# EAGLE design Selector_Gain (EAGLE 6.5.0)

## Sheet 1 of 2: In. Selector
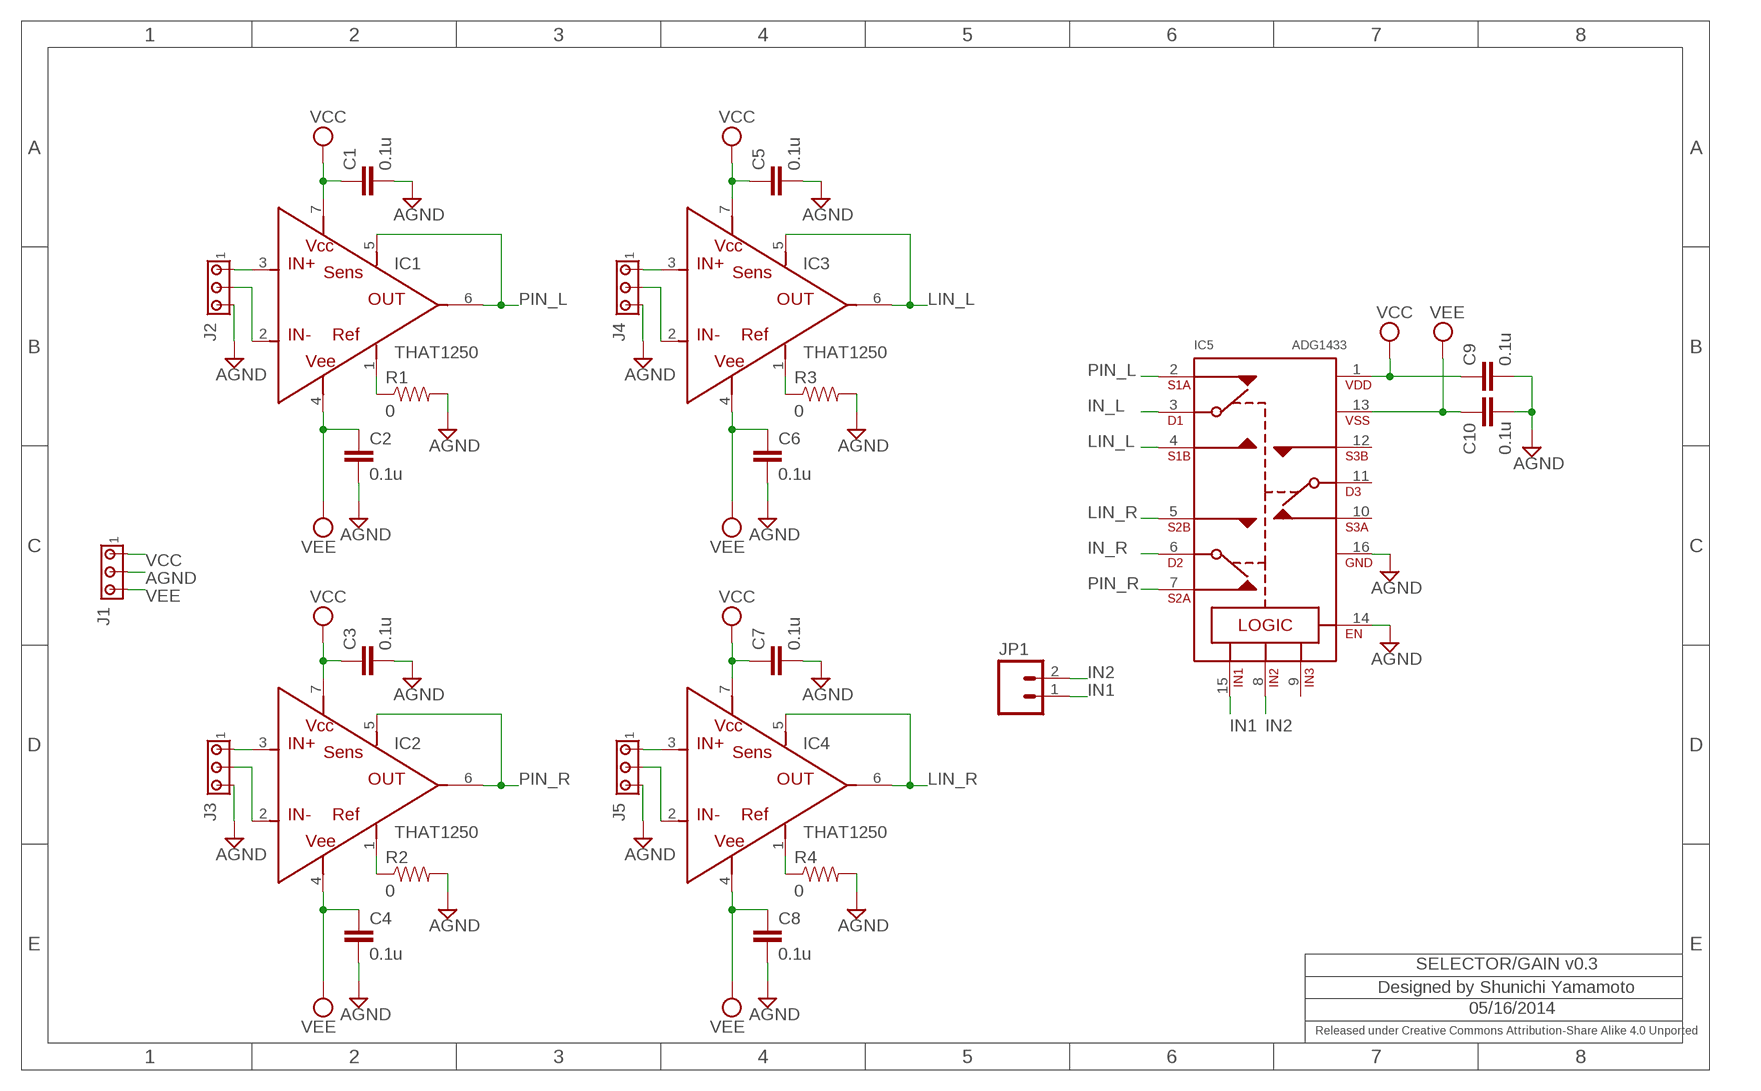
[diagram p0: schematic, sheet 1]

### Parts
C1  0.1u  C-EUC2012  [C2012]
C2  0.1u  C-EUC2012  [C2012]
C3  0.1u  C-EUC2012  [C2012]
C4  0.1u  C-EUC2012  [C2012]
C5  0.1u  C-EUC2012  [C2012]
C6  0.1u  C-EUC2012  [C2012]
C7  0.1u  C-EUC2012  [C2012]
C8  0.1u  C-EUC2012  [C2012]
C9  0.1u  C-EUC2012  [C2012]
C10  0.1u  C-EUC2012  [C2012]
IC1  THAT1250  [SOIC8]
IC2  THAT1250  [SOIC8]
IC3  THAT1250  [SOIC8]
IC4  THAT1250  [SOIC8]
IC5  ADG1433  [TSSOP16]
J1  MTA03-156  [1X3MTA]
J2  MTA03-100  [10X03MTA]
J3  MTA03-100  [10X03MTA]
J4  MTA03-100  [10X03MTA]
J5  MTA03-100  [10X03MTA]
JP1  M02PTH  [1X02]
R1  0  RESISTOR0805-RES  [0805]
R2  0  RESISTOR0805-RES  [0805]
R3  0  RESISTOR0805-RES  [0805]
R4  0  RESISTOR0805-RES  [0805]

### Nets
AGND: C1.2 C2.2 C3.2 C4.2 C5.2 C6.2 C7.2 C8.2 C9.2 C10.2 IC5.14(EN) IC5.16(GND) J1.2 J2.3 J3.3 J4.3 J5.3 R1.2 R2.2 R3.2 R4.2 ; also sheet 2
IN1: IC5.15(IN1) JP1.1
IN2: IC5.8(IN2) JP1.2
IN_L: IC5.3(D1) ; also sheet 2
IN_R: IC5.6(D2) ; also sheet 2
LIN_L: IC3.5(SENS) IC3.6(OUT) IC5.4(S1B)
LIN_R: IC4.5(SENS) IC4.6(OUT) IC5.5(S2B)
N$1: IC1.1(REF) R1.1
N$2: IC3.1(REF) R3.1
N$3: IC1.3(IN+) J2.1
N$4: IC1.2(IN-) J2.2
N$5: IC2.1(REF) R2.1
N$6: IC3.3(IN+) J4.1
N$7: IC2.3(IN+) J3.1
N$8: IC2.2(IN-) J3.2
N$9: IC3.2(IN-) J4.2
N$10: IC4.1(REF) R4.1
N$11: IC4.3(IN+) J5.1
N$12: IC4.2(IN-) J5.2
PIN_L: IC1.5(SENS) IC1.6(OUT) IC5.2(S1A)
PIN_R: IC2.5(SENS) IC2.6(OUT) IC5.7(S2A)
VCC: C1.1 C3.1 C5.1 C7.1 C9.1 IC1.7(VCC) IC2.7(VCC) IC3.7(VCC) IC4.7(VCC) IC5.1(VDD) J1.1 ; also sheet 2
VEE: C2.1 C4.1 C6.1 C8.1 C10.1 IC1.4(VEE) IC2.4(VEE) IC3.4(VEE) IC4.4(VEE) IC5.13(VSS) J1.3 ; also sheet 2
Unconnected: IC5.9(IN3) IC5.10(S3A) IC5.11(D3) IC5.12(S3B)

### Notes on the sheet
- SELECTOR/GAIN v0.3
- Designed by Shunichi Yamamoto
- 05/16/2014
- Released under Creative Commons Attribution-Share Alike 4.0 Unported

## Sheet 2 of 2: In. Gain
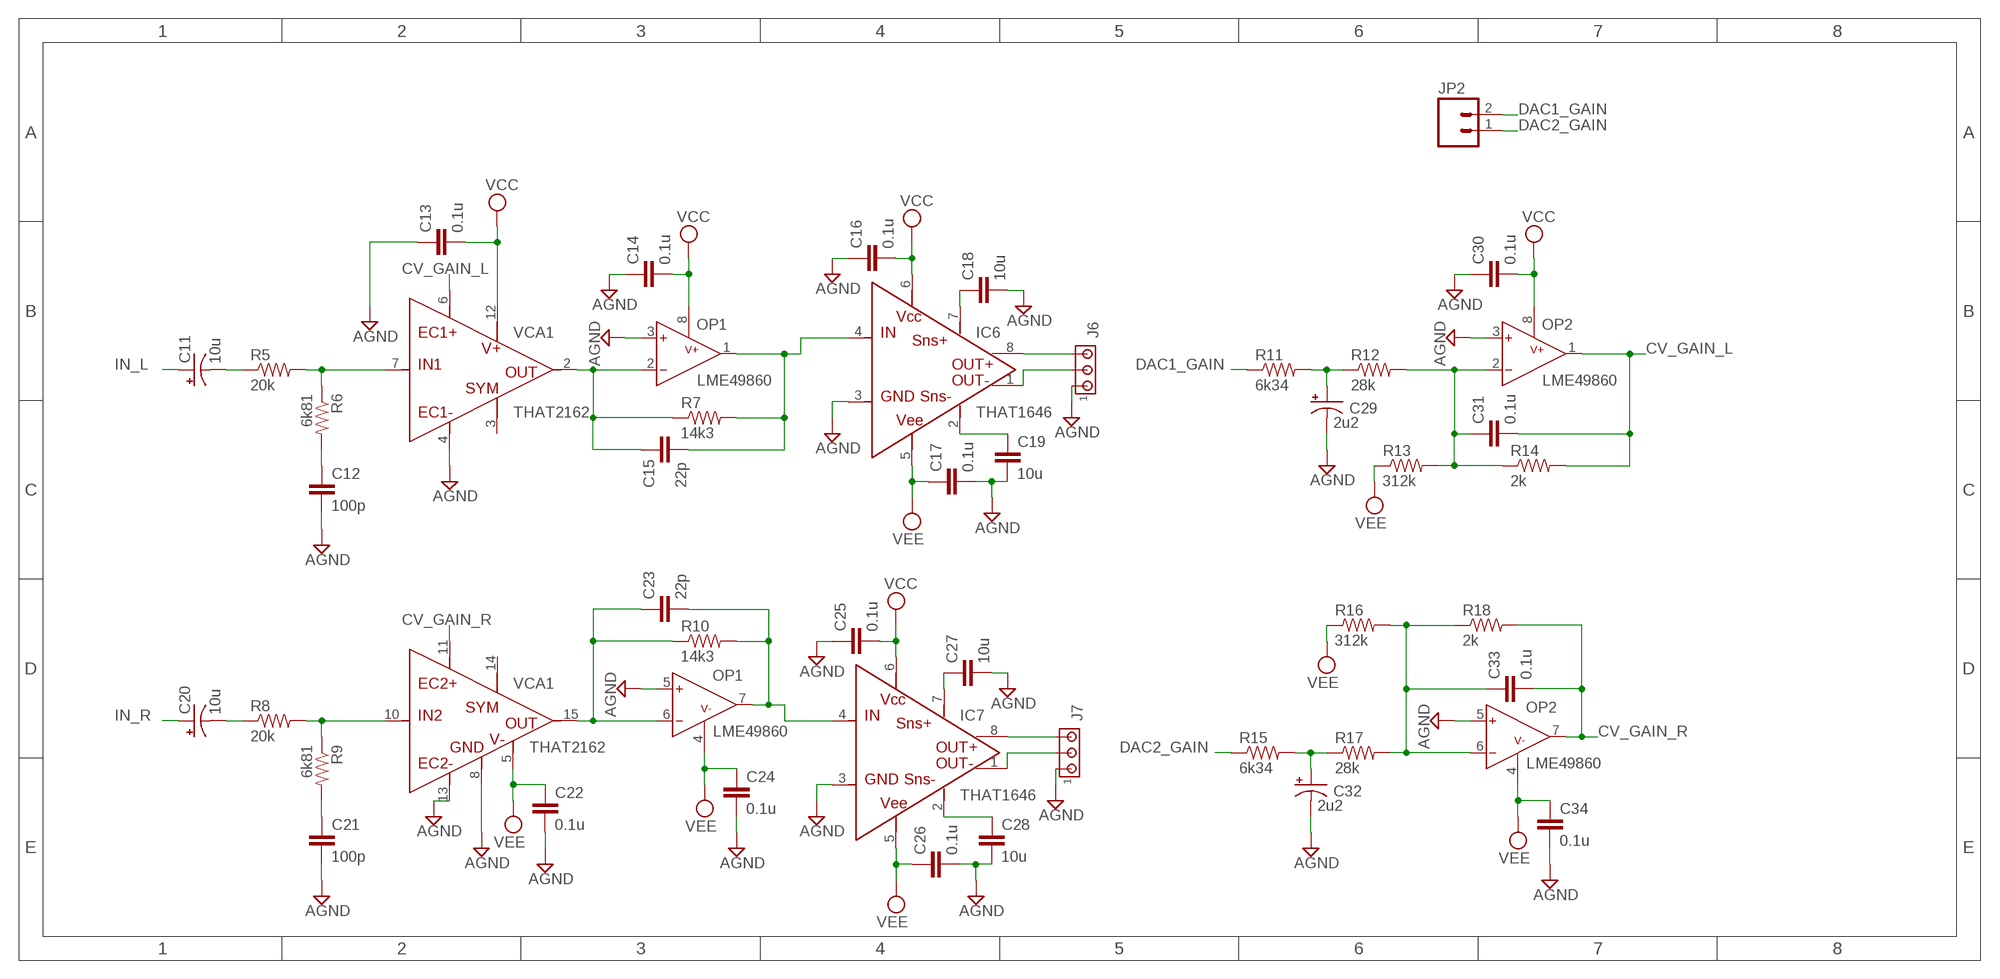
[diagram p1: schematic, sheet 2]

### Parts
C11  10u  CPOL-USUD-5X5,8  [UD-5X5,8_NICHICON]
C12  100p  C-EUC2012  [C2012]
C13  0.1u  C-EUC2012  [C2012]
C14  0.1u  C-EUC2012  [C2012]
C15  22p  C-EUC2012  [C2012]
C16  0.1u  C-EUC2012  [C2012]
C17  0.1u  C-EUC2012  [C2012]
C18  10u  C-EUC2012  [C2012]
C19  10u  C-EUC2012  [C2012]
C20  10u  CPOL-USUD-5X5,8  [UD-5X5,8_NICHICON]
C21  100p  C-EUC2012  [C2012]
C22  0.1u  C-EUC2012  [C2012]
C23  22p  C-EUC2012  [C2012]
C24  0.1u  C-EUC2012  [C2012]
C25  0.1u  C-EUC2012  [C2012]
C26  0.1u  C-EUC2012  [C2012]
C27  10u  C-EUC2012  [C2012]
C28  10u  C-EUC2012  [C2012]
C29  2u2  CPOL-USUD-5X5,8  [UD-5X5,8_NICHICON]
C30  0.1u  C-EUC2012  [C2012]
C31  0.1u  C-EUC2012  [C2012]
C32  2u2  CPOL-USUD-5X5,8  [UD-5X5,8_NICHICON]
C33  0.1u  C-EUC2012  [C2012]
C34  0.1u  C-EUC2012  [C2012]
IC6  THAT1646  [SOIC8]
IC7  THAT1646  [SOIC8]
J6  MTA03-100  [10X03MTA]
J7  MTA03-100  [10X03MTA]
JP2  M02PTH  [1X02]
OP1  LME49860  [SOIC8]
OP2  LME49860  [SOIC8]
R5  20k  RESISTOR0805-RES  [0805]
R6  6k81  RESISTOR0805-RES  [0805]
R7  14k3  RESISTOR0805-RES  [0805]
R8  20k  RESISTOR0805-RES  [0805]
R9  6k81  RESISTOR0805-RES  [0805]
R10  14k3  RESISTOR0805-RES  [0805]
R11  6k34  RESISTOR0805-RES  [0805]
R12  28k  RESISTOR0805-RES  [0805]
R13  312k  RESISTOR0805-RES  [0805]
R14  2k  RESISTOR0805-RES  [0805]
R15  6k34  RESISTOR0805-RES  [0805]
R16  312k  RESISTOR0805-RES  [0805]
R17  28k  RESISTOR0805-RES  [0805]
R18  2k  RESISTOR0805-RES  [0805]
VCA1  THAT2162  [QSOP-16]

### Nets
AGND: C12.2 C13.1 C14.1 C16.1 C17.2 C18.2 C19.2 C21.2 C22.2 C24.2 C25.1 C26.2 C27.2 C28.2 C29.- C30.1 C32.- C34.2 IC6.3(GND) IC7.3(GND) J6.1 J7.1 OP1.3(INA+) OP1.5(INB+) OP2.3(INA+) OP2.5(INB+) VCA1.4(EC1-) VCA1.8(GND) VCA1.13(EC2-) ; also sheet 1
CV_GAIN_L: C31.2 OP2.1(OUTA) R14.2 VCA1.6(EC1+)
CV_GAIN_R: C33.2 OP2.7(OUTB) R18.2 VCA1.11(EC2+)
DAC1_GAIN: JP2.2 R11.1
DAC2_GAIN: JP2.1 R15.1
IN_L: C11.+ ; also sheet 1
IN_R: C20.+ ; also sheet 1
N$13: IC6.8(OUT+) J6.3
N$14: IC6.1(OUT-) J6.2
N$15: IC7.8(OUT+) J7.3
N$16: IC7.1(OUT-) J7.2
N$17: R5.2 R6.1 VCA1.7(IN1)
N$26: C11.- R5.1
N$33: C18.1 IC6.7(SNS+)
N$34: C19.1 IC6.2(SNS-)
N$35: C27.1 IC7.7(SNS+)
N$36: C28.1 IC7.2(SNS-)
N$44: R8.2 R9.1 VCA1.10(IN2)
N$45: C20.- R8.1
N$47: C12.1 R6.2
N$48: C15.1 OP1.2(INA-) R7.1 VCA1.2(OUT1)
N$50: C21.1 R9.2
N$66: C29.+ R11.2 R12.1
N$68: C31.1 OP2.2(INA-) R12.2 R13.2 R14.1
N$70: C32.+ R15.2 R17.1
N$71: C33.1 OP2.6(INB-) R16.2 R17.2 R18.1
N$160: C23.1 OP1.6(INB-) R10.1 VCA1.15(OUT2)
OUT_L: C15.2 IC6.4(IN) OP1.1(OUTA) R7.2
OUT_R: C23.2 IC7.4(IN) OP1.7(OUTB) R10.2
VCC: C13.2 C14.2 C16.2 C25.2 C30.2 IC6.6(VCC) IC7.6(VCC) OP1.8(V+) OP2.8(V+) VCA1.12(V+) ; also sheet 1
VEE: C17.1 C22.1 C24.1 C26.1 C34.1 IC6.5(VEE) IC7.5(VEE) OP1.4(V-) OP2.4(V-) R13.1 R16.1 VCA1.5(V-) ; also sheet 1
Unconnected: VCA1.3(SYM1) VCA1.14(SYM2)

## Library data of the parts
C1-C10 C12-C19 C21-C28 C30 C31 C33 C34 = rcl:C-EU: CAPACITOR, European symbol
C11 C20 C29 C32 = rcl:CPOL-US: POLARIZED CAPACITOR, American symbol
IC1-IC4 = thatcorp:THAT1250
IC5 = thatcorp:ADG1433
IC6 IC7 = thatcorp:THAT1646
J1 = con-amp:MTA03-156: AMP connector
J2-J7 = con-amp:MTA03-100: AMP connector
JP1 JP2 = SparkFun:M02: Header 2 Standard 2-pin 0.1" header. Use with straight break away headers (SKU : PRT-00116), right angle break away headers (PRT-00553), swiss pins (PRT-00743), machine pins (PRT-00117), and female headers (PRT-00115). Molex polarized connector foot print use with SKU : PRT-08233 with associated crimp pins and housings.
OP1 OP2 = thatcorp:LME49860
R1-R18 = SparkFun:RESISTOR: Resistor Basic schematic elements and footprints for 0603, 1206, and PTH resistors.
VCA1 = thatcorp:THAT2162

## Board
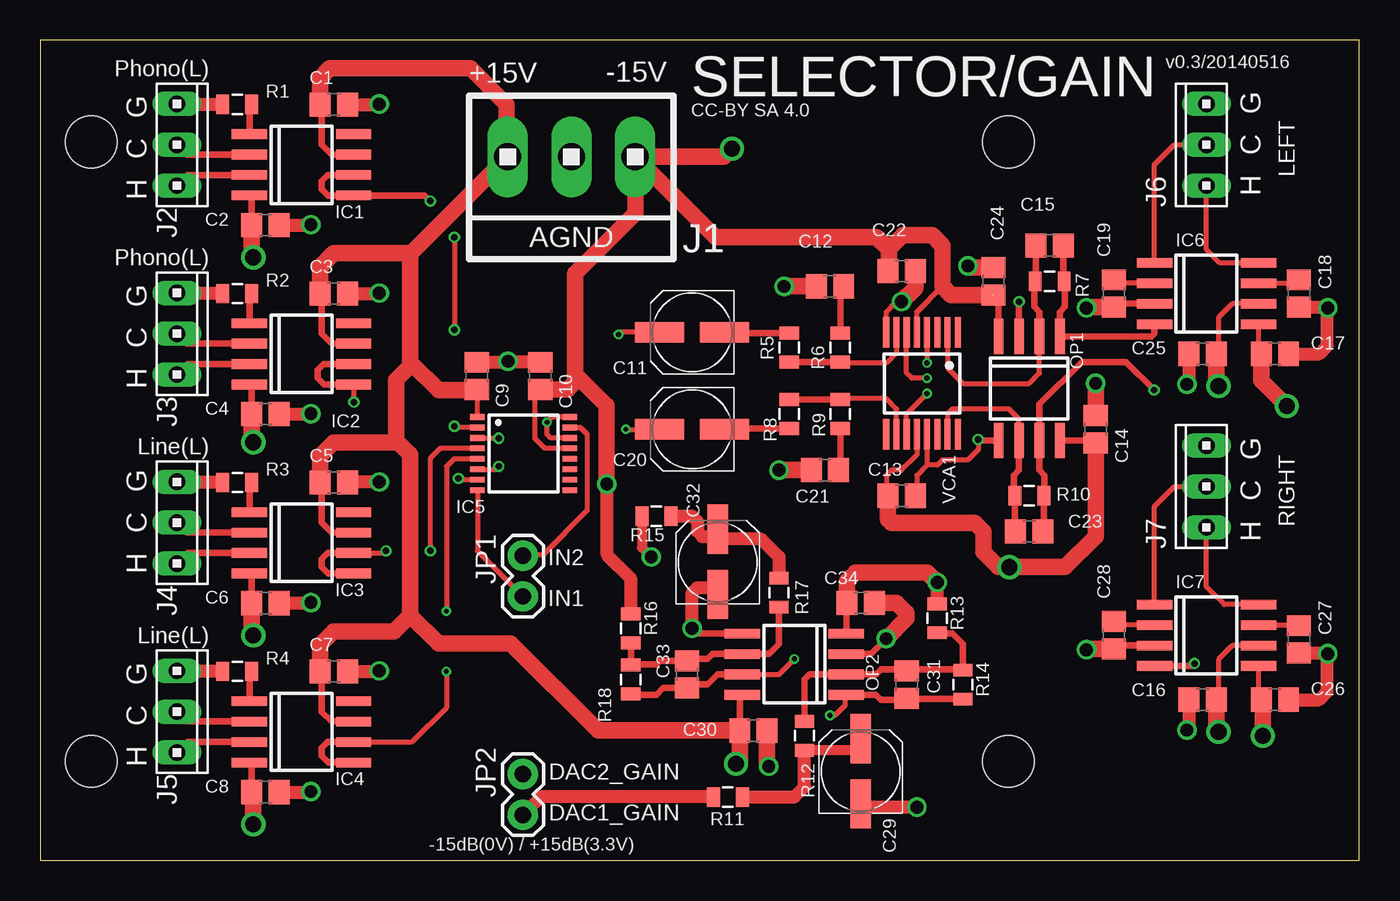
[diagram p2: board, top side]
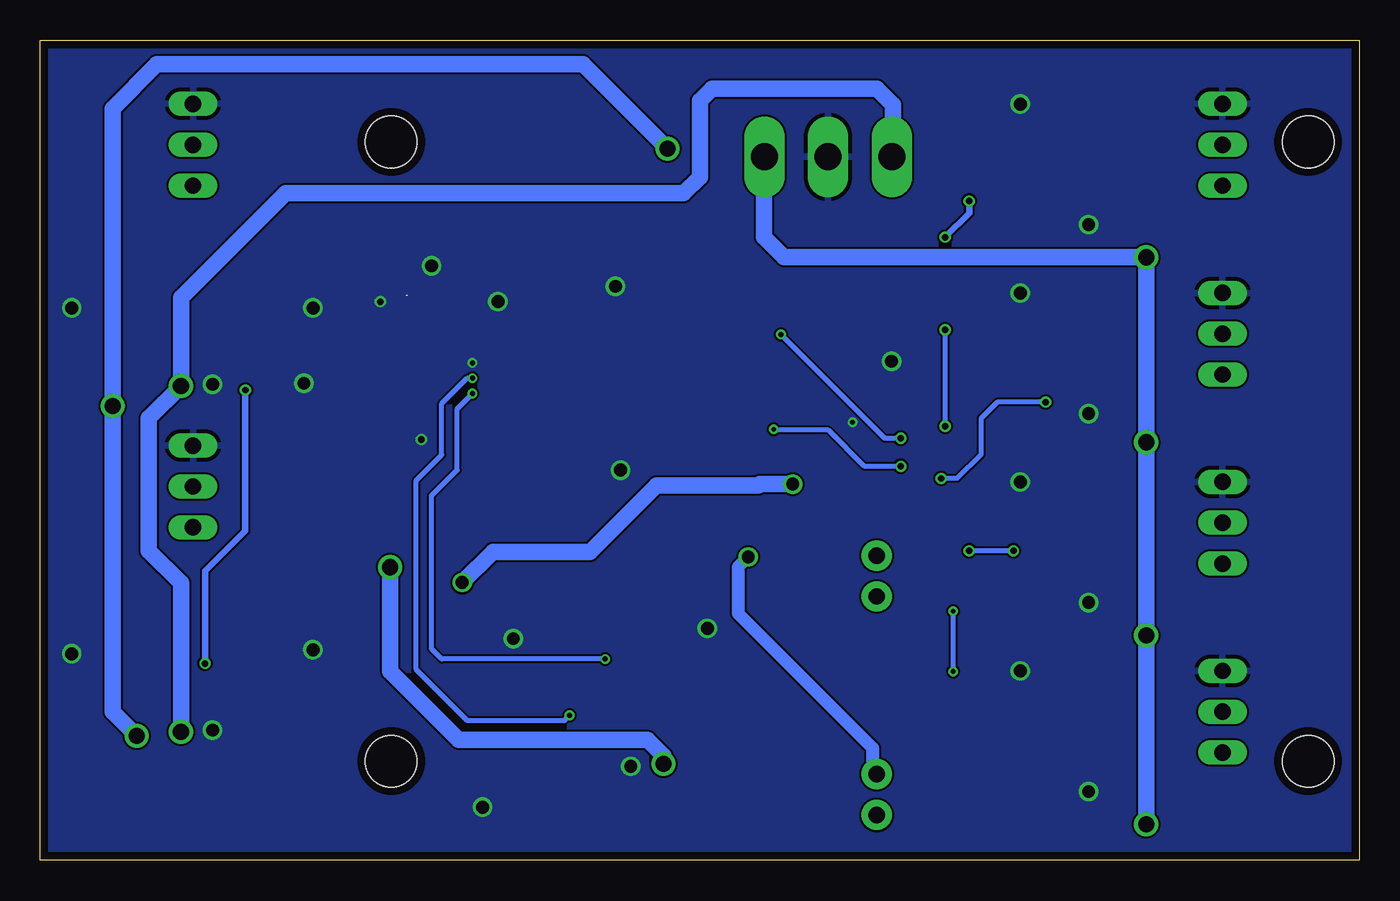
[diagram p3: board, bottom side, seen from below]

Size 82 x 51 mm. Coordinates in mm from the lower left corner, seen from the top.
Outline: 82,51 0,51 0,0 82,0 82,51
Copper layers (1*16): Top 0.035mm / dielectric 1.53mm / Bottom 0.035mm
Design rules "pban_5mil-l2": minimum track width 5mil, minimum drill 0.3mm, track to track 5mil, track to pad 0.229mm, pad to pad 5mil, via to via 5mil, smd to smd 5mil, copper to edge 0.5mm, drill to drill 0.5mm, minimum pad ring 0.15mm, minimum via ring 0.15mm, stop-mask expansion 4mil, vias tented up to drill 0.35mm, thermal gap 10mil
Holes 3.2 mm at 60.17,44.67 3.17,44.67 60.17,6.17 3.17,6.17

### Footprints (pad centres in the part's own frame; a part is rotated, then mirrored left to right if it is on the bottom)
C2012 = smd 1.3 x 1.5: 1 -0.85,0; 2 0.85,0
UD-5X5,8_NICHICON = smd 3.048 x 1.27: + 2.042,0; - -2.018,0
SOIC8 = smd 0.6 x 2.2: 1 -1.905,-3.235; 2 -0.635,-3.235; 3 0.635,-3.235; 4 1.905,-3.235; 5 1.905,3.235; 6 0.635,3.235; 7 -0.635,3.235; 8 -1.905,3.235
TSSOP16 = smd 0.9 x 0.35: 1 -2.875,2.275; 2 -2.875,1.625; 3 -2.875,0.975; 4 -2.875,0.325; 5 -2.875,-0.325; 6 -2.875,-0.975; 7 -2.875,-1.625; 8 -2.875,-2.275; 9 2.875,-2.275; 10 2.875,-1.625; 11 2.875,-0.975; 12 2.875,-0.325; 13 2.875,0.325; 14 2.875,0.975; 15 2.875,1.625; 16 2.875,2.275
1X3MTA = drill 1.676 long: 1 3.937,0; 2 -0.025,0; 3 -3.988,0
10X03MTA = drill 1.016 long: 1 2.54,0; 2 0,0; 3 -2.54,0
1X02 = drill 1.016 pad 1.88: 1 0,0; 2 2.54,0
0805 = smd 0.8 x 1.2: 1 -0.9,0; 2 0.9,0
QSOP-16 = smd 0.381 x 1.905: 1 0.318,-0.635; 2 0.953,-0.635; 3 1.587,-0.635; 4 2.223,-0.635; 5 2.857,-0.635; 6 3.493,-0.635; 7 4.128,-0.635; 8 4.763,-0.635; 9 4.763,5.715; 10 4.128,5.715; 11 3.493,5.715; 12 2.857,5.715; 13 2.223,5.715; 14 1.587,5.715; 15 0.953,5.715; 16 0.318,5.715

### Placement (x,y rotation side)
C1  18.25,47 0 top
C2  14,39.5 0 top
C3  18.25,35.25 0 top
C4  14,27.75 0 top
C5  18.25,23.5 0 top
C6  14,16 0 top
C7  18.25,11.75 0 top
C8  14,4.25 0 top
C9  27.14,30.12 90 top
C10  31.09,30.12 90 top
C11  40.53,32.84 180 top
C12  49.1,35.7 180 top
C13  53.55,22.68 180 top
C14  65.61,26.81 270 top
C15  62.75,38.24 0 top
C16  72.25,10 0 top
C17  76.75,31.5 0 top
C18  78.25,35.25 270 top
C19  66.75,35.25 270 top
C20  40.53,26.81 180 top
C21  48.78,24.27 180 top
C22  53.55,36.65 0 top
C23  61.48,20.46 0 top
C24  59.26,36.02 90 top
C25  72.25,31.5 0 top
C26  76.75,10 0 top
C27  78.25,13.75 270 top
C28  66.75,14 270 top
C29  51.01,5.54 90 top
C30  44.34,8.07 180 top
C31  53.86,10.93 270 top
C32  42.12,18.55 90 top
C33  40.21,11.57 270 top
C34  51.01,16.01 0 top
IC1  16.25,43.25 270 top
IC2  16.25,31.5 270 top
IC3  16.25,19.75 270 top
IC4  16.25,8 270 top
IC5  30.05,25.3 0 top
IC6  72.5,35.25 270 top
IC7  72.5,14 270 top
J1  33,43.75 180 top
J2  8.5,44.5 270 top
J3  8.5,32.75 270 top
J4  8.5,21 270 top
J5  8.5,9.25 270 top
J6  72.5,44.5 90 top
J7  72.5,23.25 90 top
JP1  30,18.95 270 top
JP2  30,5.37 270 top
OP1  61.48,29.35 180 top
OP2  46.88,12.2 90 top
R1  12.25,47 180 top
R2  12.25,35.25 180 top
R3  12.25,23.5 180 top
R4  12.25,11.75 180 top
R5  46.56,31.89 270 top
R6  49.73,31.89 90 top
R7  62.75,36.02 0 top
R8  46.56,27.76 90 top
R9  49.73,27.76 270 top
R10  61.48,22.68 0 top
R11  42.75,3.95 0 top
R12  47.51,7.76 90 top
R13  55.77,15.06 270 top
R14  57.35,10.93 270 top
R15  38.3,21.41 0 top
R16  36.72,14.43 270 top
R17  45.92,16.65 270 top
R18  36.72,11.25 270 top
VCA1  57.35,32.2 180 top

### Tracks (layer width: path | path; a pad name or v marks a point on that pad's centre or on a via)
AGND  (via drill 0.3, 0.41, 0.8)
  Top 0.305: VCA1.13 55.13,24.59 | 55.13,24.59 54.5,23.95 54.5,22.78 C13.1 | v58.31,26.17 58.31,25.54 57.67,24.9 56.09,24.9 55.77,24.59 55.13,24.59 | VCA1.8 52.59,34.11 53.23,34.74 v53.55,34.74 | VCA1.4 v55.13,30.93 | IC5.16 31.82,27.57 v31.5,27.25 31.5,26.5 31.73,26.27 IC5.14
  Top 0.406: OP1.3 v60.85,34.74 | OP1.5 58.37,26.11 v58.31,26.17 | OP2.5 40.84,14.11 v40.53,14.43 | OP2.3 51.64,12.84 v52.59,13.79 | IC6.3 66.97,34.62 C19.2 | IC7.3 66.97,13.37 C28.2
  Top 0.813: v40.53,14.43 40.53,16.65 40.84,16.96 41.95,16.96 C32.- | v54.5,3.31 51.21,3.31 C29.- | C8.2 16.8,4.25 v16.83,4.28 | C7.2 21.05,11.75 v21.08,11.78 | C6.2 16.8,16 v16.83,16.03 | v21.08,23.53 19.13,23.53 C5.2 | C4.2 16.8,27.75 v16.83,27.78 | C3.2 21.05,35.25 v21.08,35.28 | C2.2 16.8,39.5 v16.83,39.53 | C1.2 21.05,47 v21.08,47.03 | R1.2 8.54,47 J2.3 | R2.2 8.54,35.25 J3.3 | R3.2 8.54,23.5 J4.3 | R4.2 8.54,11.75 J5.3 | C9.2 29.02,30.98 v29.08,31.03 29.14,30.98 C10.2 | C18.2 79.99,34.4 v80.04,34.35 80,34.31 80,32 79.5,31.5 C17.2 | C27.2 79.99,12.9 v80.04,12.85 80,12.81 80,10.5 79.5,10 C26.2 | C16.1 71.4,8.21 v71.29,8.1 | C25.1 71.4,29.71 v71.29,29.6
  Top 1.016: C21.2 v45.92,24.27 | C12.2 v46.24,35.7 | C14.1 v65.61,29.66 | C24.2 57.77,36.87 v57.67,36.97 | C30.1 45.19,5.96 v45.29,5.85 | C34.2 53.23,16.01 53.86,15.38 53.86,15.06 v52.59,13.79 | C22.2 54.4,35.59 v53.55,34.74 | C19.2 65.09,34.4 v65.04,34.35 | C28.2 65.09,13.15 v65.04,13.1
  pour Bottom: 82.32,-0.3 82.32,51.3 -0.3,51.3 -0.3,-0.3
CV_GAIN_L  (via drill 0.3)
  Top 0.305: v49.1,9.03 49.42,9.03 50.05,9.66 50.05,10.24 OP2.1 | VCA1.6 53.86,30.3 54.18,29.98 v55.13,29.98
  Top 0.406: OP2.1 51.96,10.3 52.27,9.98 53.86,9.98 C31.2 53.86,10.03 R14.2
  Bottom 0.305: v49.1,9.03 49.42,8.71 55.45,8.71 58.62,11.88 58.62,23.63 57.04,25.22 57.04,28.39 55.45,29.98 v55.13,29.98
CV_GAIN_R  (via drill 0.3)
  Top 0.305: OP2.7 45.92,11.57 v46.88,12.52 | VCA1.11 53.86,27.76 v55.13,29.03
  Top 0.406: OP2.7 42.12,11.57 41.48,10.93 40.42,10.93 C33.2 38.73,10.72 38.3,10.3 36.77,10.3 R18.2
  Bottom 0.305: v46.88,12.52 57.04,12.52 57.67,13.15 57.67,22.68 56.09,24.27 56.09,28.08 v55.13,29.03
DAC1_GAIN
  Top 0.813: R11.1 31.12,3.95 JP2.2
DAC2_GAIN  (via drill 0.8)
  Top 0.61: R15.1 37.41,19.45 v37.99,18.87
  Bottom 0.813: v37.99,18.87 38.62,18.23 38.62,15.37 30.25,7 30.25,5.62 JP2.1
IN1
  Top 0.305: IC5.15 33.58,26.92 34,26.5 34,21.75 31.25,19 30.05,19 JP1.1
IN2
  Top 0.305: IC5.8 27.18,19.24 JP1.2
IN_L  (via drill 0.3, 0.4)
  Top 0.305: C11.+ 36.08,32.84 v35.95,32.7 | IC5.3 28.48,26.27 v28.5,26.25
  Bottom 0.305: v28.5,26.25 29.49,26.25 v35.95,32.7
IN_R  (via drill 0.3, 0.4)
  Top 0.305: v36.4,26.81 C20.+ | IC5.6 28.32,24.32 v28.5,24.5
  Bottom 0.305: v28.5,24.5 30.75,24.5 33,26.75 36.34,26.75 v36.4,26.81
LIN_L  (via drill 0.4)
  Top 0.305: IC3.6 21.36,19.11 v21.5,19.25 | IC5.4 24.87,25.62 24.25,25 v24.25,19.25
  Top 0.406: IC3.5 17.91,17.84 17.5,18.25 17.5,18.75 17.86,19.11 IC3.6
  Bottom 0.305: v21.5,19.25 v24.25,19.25
LIN_R  (via drill 0.3)
  Top 0.305: 27.17,24.98 IC5.5 25.72,24.97 25.25,24.5 v25.25,15.5 | IC4.6 23.11,7.37 25.25,9.5 v25.25,11.75
  Top 0.406: IC4.6 17.86,7.37 17.5,7 17.5,6.5 17.91,6.09 IC4.5
  Bottom 0.305: v25.25,15.5 v25.25,11.75
N$1
  Top 0.406: IC1.1 13.02,46.87 R1.1
N$2
  Top 0.406: IC3.1 13.02,23.36 R3.1
N$3
  Top 0.406: IC1.3 9.15,42.62 J2.1
N$4
  Top 0.406: IC1.2 9.12,43.88 J2.2
N$5
  Top 0.406: IC2.1 13.02,35.12 R2.1
N$6
  Top 0.406: IC3.3 9.15,19.11 J4.1
N$7
  Top 0.406: IC2.3 9.15,30.86 J3.1
N$8
  Top 0.406: IC2.2 9.12,32.13 J3.2
N$9
  Top 0.406: IC3.2 9.12,20.39 J4.2
N$10
  Top 0.406: IC4.1 13.02,11.62 R4.1
N$11
  Top 0.406: IC4.3 9.15,7.37 J5.1
N$12
  Top 0.406: IC4.2 9.12,8.63 J5.2
N$13
  Top 0.305: IC6.8 73.34,37.16 72.5,38 J6.3
N$14
  Top 0.305: IC6.1 69.27,43.27 70.5,44.5 J6.2
N$15
  Top 0.305: IC7.8 73.59,15.9 72.5,17 J7.3
N$16
  Top 0.305: IC7.1 69.27,22.02 70.5,23.25 J7.2
N$17
  Top 0.305: VCA1.7 53.23,31.57 52.59,30.93 49.47,30.93 R6.1
  Top 0.406: R5.2 R6.1
N$26
  Top 0.406: R5.1 42.63,32.79 C11.-
N$33
  Top 0.305: IC6.7 78.03,35.88 C18.1
N$34
  Top 0.305: IC6.2 66.97,35.88 C19.1
N$35
  Top 0.305: IC7.7 78.22,14.63 C27.1
N$36
  Top 0.305: IC7.2 66.97,14.63 C28.1
N$44
  Top 0.305: VCA1.10 53.23,28.08 52.59,28.71 49.15,28.71 R9.1
  Top 0.406: R8.2 R9.1
N$45
  Top 0.406: R8.1 42.63,26.86 C20.-
N$47
  Top 0.406: R6.2 49.73,35.59 C12.1
N$48
  Top 0.305: VCA1.2 56.4,30.62 57.35,29.66 61.48,29.66 62.12,30.3 OP1.2
  Top 0.406: OP1.2 62.12,34.11 61.8,34.43 61.8,35.96 R7.1 61.9,36.06 C15.1
N$50
  Top 0.406: R9.2 49.73,24.37 C21.1
N$66
  Top 0.61: R12.1 50.95,6.86 50.95,7.53 C29.+
  Top 0.813: R11.2 46.88,3.95 47.51,4.58 R12.1
N$68
  Top 0.406: R12.2 47.51,11.25 47.83,11.57 OP2.2 51.96,11.57 52.27,11.88 53.86,11.88 | 53.86,11.88 C31.1 | R13.2 55.82,14.11 56.72,14.11 57.35,13.47 R14.1 57.3,11.88 53.86,11.88
N$70
  Top 0.813: R15.2 40.53,21.41 40.84,21.09 40.84,20.46 41.16,20.14 41.95,20.14 C32.+ 42.12,19.82 42.27,19.98 44.82,19.98 45.92,18.87 R17.1
N$71
  Top 0.406: R17.2 45.92,13.47 45.29,12.84 OP2.6 41.8,12.84 41.48,12.52 40.31,12.52 C33.1 38.52,12.42 38.3,12.2 36.77,12.2 R18.1 R16.2
N$160
  Top 0.305: OP1.6 60.85,27.44 60.21,28.08 56.72,28.08 56.4,27.76 VCA1.15
  Top 0.406: OP1.6 60.85,24.27 60.53,23.95 60.53,22.73 R10.1 60.58,20.51 C23.1
OUT_L
  Top 0.305: 69.25,33.33 IC6.4
  Top 0.406: C15.2 63.6,36.06 R7.2 63.7,35.96 63.7,34.43 63.39,34.11 OP1.1 69.08,32.58 69.25,32.75 69.25,33.33
OUT_R  (via drill 0.4)
  Top 0.406: C23.2 62.38,20.51 R10.2 62.44,22.73 62.44,23.95 62.12,24.27 OP1.7 62.12,28.37 64.75,31 67.5,31 v69.25,29.25 | IC7.4 71.59,12.1 v71.75,12.25
  Bottom 0.406: v69.25,29.25 69.25,20.5 71.75,18 v71.75,12.25
PIN_L  (via drill 0.4)
  Top 0.305: v25.75,38.75 v25.75,33 | IC5.2 25.83,26.92 v25.75,27
  Top 0.406: v24.25,41 23.91,41.34 IC1.5 17.91,41.34 17.5,41.75 17.5,42.25 17.86,42.62 IC1.6
  Bottom 0.305: v25.75,33 v25.75,27
  Bottom 0.406: v24.25,41 24.25,40.25 v25.75,38.75
PIN_R  (via drill 0.4)
  Top 0.305: IC2.5 19.48,28.52 v19.5,28.5 | IC5.7 26.08,23.67 v26,23.75
  Top 0.406: IC2.5 17.66,29.59 17.25,30 17.25,30.5 17.61,30.86 IC2.6
  Bottom 0.305: v19.5,28.5 22.5,28.5 23.5,27.5 23.5,25.25 25,23.75 v26,23.75
VCC  (via drill 1)
  Top 0.305: VCA1.12 54.5,25.22 53.55,24.27 52.91,24.27 52.59,23.95 52.59,22.78 C13.2 | IC5.1 27.18,29.25 C9.1 | IC6.6 74.11,34.62 73.25,33.75 73.25,31.65 C25.2 | IC7.6 74.11,13.37 73.25,12.5 73.25,10.15 C16.2
  Top 0.406: OP1.8 65.61,26.11 C14.2 | OP2.8 43.49,10.14 C30.2 | IC2.7 18.11,32.13 17.5,32.75 17.5,35.15 C3.1 | IC3.7 18.11,20.39 17.5,21 17.5,23.4 C5.1 | IC4.7 18.11,8.63 17.5,9.25 17.5,11.65 C7.1 | IC1.7 18.11,43.88 17.5,44.5 17.5,46.9 C1.1
  Top 1.016: C14.2 65.61,20.14 63.7,18.23 v60.25,18.23 59.58,18.23 58.62,19.19 58.62,20.46 58.09,20.99 52.91,20.99 52.7,21.2 C13.2 | C1.1 17.4,48.65 18,49.25 26.75,49.25 29,47 29,43.81 J1.1 23.06,37.75 | C3.1 17.4,36.9 18.25,37.75 23.06,37.75 | C5.1 17.4,25.15 18.25,26 22,26 22.12,26.12 | 23.06,37.75 23,37.69 23,31 23.12,30.88 | C7.1 17.4,13.4 18.25,14.25 22,14.25 23,15.25 | 23,15.25 23,25.25 22.12,26.12 | 27.18,29.25 24.75,29.25 23.12,30.88 | 22.12,26.12 22.12,29.88 23.12,30.88 | 23,15.25 24.75,13.5 29.25,13.5 34.67,8.07 C30.2 43.49,6.24 v43.25,6 | C16.2 73.1,8.15 v73.25,8 | C25.2 73.1,29.65 v73.25,29.5
  Bottom 1.016: v43.25,6 43.25,6.5 44.25,7.5 56,7.5 60.25,11.75 v60.25,18.23 | v73.25,8 73.25,17.25 75.25,19.25 75.25,27.5 v73.25,29.5 73.25,35 66.75,41.5 42,41.5 41,42.5 41,47.25 40.25,48 30,48 29,47 29,43.81 J1.1
VEE  (via drill 0.8, 1)  (1 unrouted)
  Top 0.305: VCA1.5 54.5,34.11 56.09,35.7 | IC5.13 31.38,25.62 30.75,26.25 30.75,28.93 C10.1 | IC6.5 75.73,31.66 C17.1 | IC7.5 75.73,10.16 C26.1
  Top 0.406: OP1.4 59.58,34.85 C24.1 | OP2.4 50.11,15.97 C34.1 | C8.1 13.15,5.96 IC4.4 | C6.1 13.15,17.71 IC3.4 | C4.1 13.15,29.46 IC2.4 | C2.1 13.15,41.21 IC1.4
  Top 0.813: R13.1 v55.77,17.28 | R16.1 36.72,17.53 35.25,19 35.25,23.36 v35.22,23.4
  Top 1.016: 59.16,35.16 56.62,35.16 56.09,35.7 56.09,38.24 55.45,38.87 53.62,38.87 52.75,38 | C34.1 50.16,17.39 50.69,17.92 55.13,17.92 v55.77,17.28 | C2.1 13.15,37.6 v13.25,37.5 | C4.1 13.15,26.1 v13.25,26 | C6.1 13.15,14.1 v13.25,14 | v13.25,2.25 13.25,4.15 C8.1 | C10.1 32.77,29.27 33.25,29.75 33.25,30.25 | 33.25,30.25 33.25,36.5 37,40.25 37,43.74 J1.3 | J1.3 41.97,38.77 51.98,38.77 52.75,38 | 52.75,38 52.75,36.7 C22.1 | v35.22,23.4 35.22,28.28 33.25,30.25 | C17.1 75.9,29.85 v77.5,28.25 | v76,7.75 76,9.9 C26.1 | v43,44.25 42.5,43.75 J1.3
  Bottom 1.016: v55.77,17.28 53.86,19.19 47.83,19.19 43.7,23.32 37.35,23.32 37.27,23.4 v35.22,23.4 | J1.3 37,43.74 37,38.75 35.75,37.5 v13.25,37.5 v13.25,26 v13.25,14 v13.25,2.25 | v76,7.75 77.5,9.25 v77.5,28.25 77.5,46.75 74.75,49.5 48.25,49.5 v43,44.25

### Text on the board
tNames: Phono(L) | v0.3/20140516 | +15V | -15V | SELECTOR/GAIN | G | CC-BY SA 4.0 | G | C | C | LEFT | H | H | Phono(L) | AGND | G | C | H | Line(L) | G | G | C | RIGHT | C | H | H | IN2 | IN1 | Line(L) | G | C | H | DAC2_GAIN | DAC1_GAIN | -15dB(0V) / +15dB(3.3V)